# EAGLE design V2 (EAGLE 7.2.0)
DESIGNER: @qrohlf; REVISION: v3
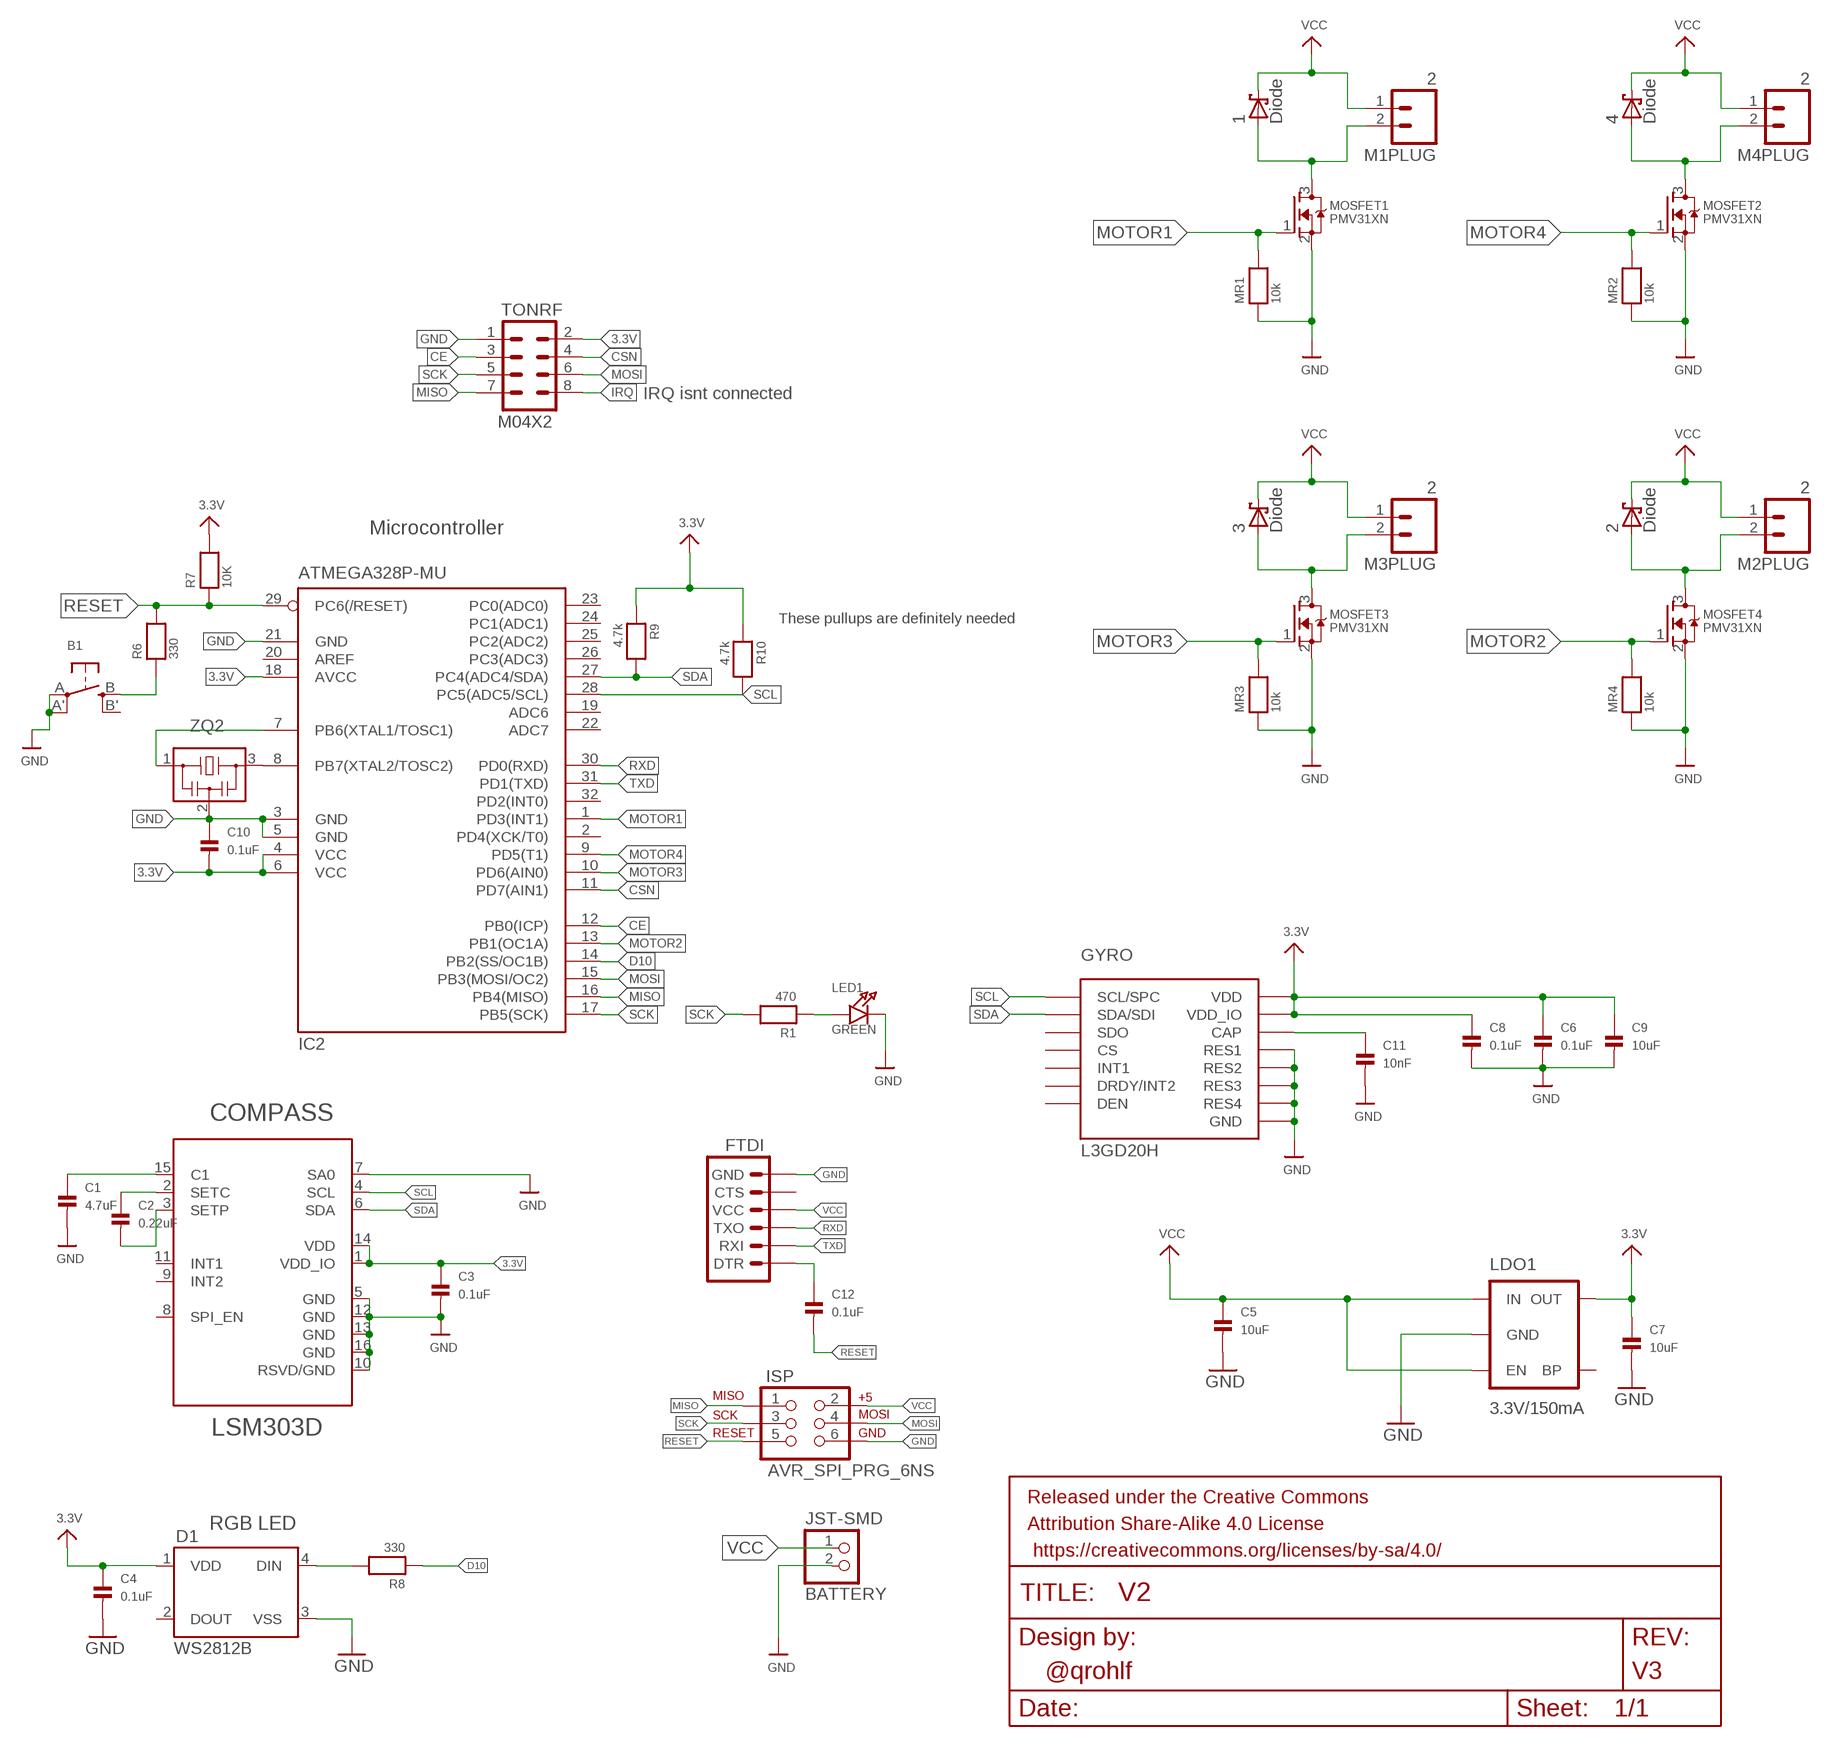
[diagram p0: schematic, sheet 1]

## Parts
1  Diode  BAS40  [SOT23]
2  Diode  BAS40  [SOT23]
3  Diode  BAS40  [SOT23]
4  Diode  BAS40  [SOT23]
B1  SWITCH_TACT_SMT4.6X2.8  [BTN_KMR2_4.6X2.8]
BATTERY  JST-SMD  JST_2PIN-SMT-RA  [JST-PH-2-SMT-RA]
C1  4.7uF  CAP_CERAMIC0603MINI  [0603-MINI]
C2  0.22uF  CAP_CERAMIC0603MINI  [0603-MINI]
C3  0.1uF  CAP_CERAMIC0603MINI  [0603-MINI]
C4  0.1uF  CAP_CERAMIC0603MINI  [0603-MINI]
C5  10uF  CAP_CERAMIC0603MINI  [0603-MINI]
C6  0.1uF  CAP_CERAMIC0603MINI  [0603-MINI]
C7  10uF  CAP_CERAMIC0603MINI  [0603-MINI]
C8  0.1uF  CAP_CERAMIC0603MINI  [0603-MINI]
C9  10uF  CAP_CERAMIC0603MINI  [0603-MINI]
C10  0.1uF  CAP_CERAMIC0603MINI  [0603-MINI]
C11  10nF  CAP_CERAMIC0603MINI  [0603-MINI]
C12  0.1uF  CAP_CERAMIC0603MINI  [0603-MINI]
COMPASS  LSM303D  [LGA16_3X5]
D1  WS2812B  [WS2812B]
FRAME1  >VERSION  FRAME-LETTERNO_PACKAGE  [DUMMY]
FTDI  ARDUINO_SERIAL_PROGRAMLOCK  [1X06_LOCK]
IC2  ATMEGA328P-MU  MEGA8-AI  [TQFP32-08]
ISP  AVR_SPI_PRG_6NS  [2X3-NS]
L3GD20H  L3GD20H  [LGA16L]
LDO1  3.3V/150mA  V_REG_MIC52053.3V  [SOT23-5]
LED1  GREEN  LED0603  [CHIPLED_0603]
M1PLUG  2  M02POLAR_LOCK  [MOLEX-1X2_LOCK]
M2PLUG  2  M02POLAR_LOCK  [MOLEX-1X2_LOCK]
M3PLUG  2  M02POLAR_LOCK  [MOLEX-1X2_LOCK]
M4PLUG  2  M02POLAR_LOCK  [MOLEX-1X2_LOCK]
MOSFET1  PMV31XN  MOSFET-NREFLOW  [SOT23-R]
MOSFET2  PMV31XN  MOSFET-NREFLOW  [SOT23-R]
MOSFET3  PMV31XN  MOSFET-NREFLOW  [SOT23-R]
MOSFET4  PMV31XN  MOSFET-NREFLOW  [SOT23-R]
MR1  10k  RESISTOR0603MINI  [0603-MINI]
MR2  10k  RESISTOR0603MINI  [0603-MINI]
MR3  10k  RESISTOR0603MINI  [0603-MINI]
MR4  10k  RESISTOR0603MINI  [0603-MINI]
R1  470  RESISTOR0603MINI  [0603-MINI]
R6  330  RESISTOR0603MINI  [0603-MINI]
R7  10K  RESISTOR0603MINI  [0603-MINI]
R8  330  RESISTOR0603MINI  [0603-MINI]
R9  4.7k  RESISTOR0603MINI  [0603-MINI]
R10  4.7k  RESISTOR0603MINI  [0603-MINI]
TONRF  M04X2  [2X4]
ZQ2  CSTCE8M00G52-R0  [CSTCE]

## Nets
3.3V: C3.1 C4.1 C6.1 C7.1 C8.1 C9.1 C10.2 COMPASS.1(VDD_IO) COMPASS.14(VDD) D1.1(VDD) IC2.4(VCC) IC2.6(VCC) IC2.18(AVCC) L3GD20H.P$1(VDD_IO) L3GD20H.P$16(VDD) LDO1.5(OUT) R7.2 R9.1 R10.1 TONRF.2
C1: C1.1 COMPASS.15(C1)
CE: IC2.12(PB0(ICP)) TONRF.3
CSN: IC2.11(PD7(AIN1)) TONRF.4
D10: IC2.14(PB2(SS/OC1B)) R8.1
GND: B1.A'(P1) B1.A(P) BATTERY.2 C1.2 C3.2 C4.2 C5.2 C6.2 C7.2 C8.2 C9.2 C10.1 C11.2 COMPASS.5(GND) COMPASS.7(SA0) COMPASS.10(RSVD/GND) COMPASS.12(GND) COMPASS.13(GND) COMPASS.16(GND) D1.3(VSS) FTDI.6(GND) IC2.3(GND) IC2.5(GND) IC2.21(GND) ISP.6 L3GD20H.P$9(RES1) L3GD20H.P$10(RES2) L3GD20H.P$11(RES3) L3GD20H.P$12(GND) L3GD20H.P$13(GND) L3GD20H.P$15(RES4) LDO1.2(GND) LED1.C MOSFET1.2(S) MOSFET2.2(S) MOSFET3.2(S) MOSFET4.2(S) MR1.1 MR2.1 MR3.1 MR4.1 TONRF.1 ZQ2.2
IRQ: TONRF.8
MISO: IC2.16(PB4(MISO)) ISP.1 TONRF.7
MOSI: IC2.15(PB3(MOSI/OC2)) ISP.4 TONRF.6
MOTOR1: IC2.1(PD3(INT1)) MOSFET1.1(G) MR1.2
MOTOR2: IC2.13(PB1(OC1A)) MOSFET4.1(G) MR4.2
MOTOR3: IC2.10(PD6(AIN0)) MOSFET3.1(G) MR3.2
MOTOR4: IC2.9(PD5(T1)) MOSFET2.1(G) MR2.2
N$1: B1.B(S) R6.1
N$2: C12.1 FTDI.1(DTR)
N$4: D1.4(DIN) R8.2
N$5: LED1.A R1.1
N$6: C11.1 L3GD20H.P$14(CAP)
N$7: 3.1(A) M3PLUG.2 MOSFET3.3(D)
N$8: 2.1(A) M2PLUG.2 MOSFET4.3(D)
N$9: IC2.8(PB7(XTAL2/TOSC2)) ZQ2.3
N$10: IC2.7(PB6(XTAL1/TOSC1)) ZQ2.1
N$11: 1.1(A) M1PLUG.2 MOSFET1.3(D)
N$12: 4.1(A) M4PLUG.2 MOSFET2.3(D)
RESET: C12.2 IC2.29(PC6(/RESET)) ISP.5 R6.2 R7.1
RXD: FTDI.3(TXO) IC2.30(PD0(RXD))
SCK: IC2.17(PB5(SCK)) ISP.3 R1.2 TONRF.5
SCL: COMPASS.4(SCL) IC2.28(PC5(ADC5/SCL)) L3GD20H.P$2(SCL/SPC) R10.2
SDA: COMPASS.6(SDA) IC2.27(PC4(ADC4/SDA)) L3GD20H.P$3(SDA/SDI) R9.2
SETC: C2.1 COMPASS.2(SETC)
SETP: C2.2 COMPASS.3(SETP)
TXD: FTDI.2(RXI) IC2.31(PD1(TXD))
VCC: 1.3(C) 2.3(C) 3.3(C) 4.3(C) BATTERY.1 C5.1 FTDI.4(VCC) ISP.2 LDO1.1(IN) LDO1.3(EN) M1PLUG.1 M2PLUG.1 M3PLUG.1 M4PLUG.1
Unconnected: B1.B'(S1) COMPASS.8(SPI_EN) COMPASS.9(INT2) COMPASS.11(INT1) D1.2(DOUT) FTDI.5(CTS) IC2.2(PD4(XCK/T0)) IC2.19(ADC6) IC2.20(AREF) IC2.22(ADC7) IC2.23(PC0(ADC0)) IC2.24(PC1(ADC1)) IC2.25(PC2(ADC2)) IC2.26(PC3(ADC3)) IC2.32(PD2(INT0)) L3GD20H.P$4(SDO) L3GD20H.P$5(CS) L3GD20H.P$6(DRDY/INT2) L3GD20H.P$7(INT1) L3GD20H.P$8(DEN) LDO1.4(BP)

## Notes on the sheet
- IRQ isnt connected
- Microcontroller
- These pullups are definitely needed
- GYRO
- L3GD20H
- RGB LED

## Library data of the parts
1-4 = diode:BAS40: Silicon Schottky Diodes General-purpose diode for high-speed switching
B1 = microbuilder:SWITCH_TACT_SMT: SMT Tact Switches 6x6mm - Digikey: P12940SCT-ND KMR2 (4.6x2.8mm) - Digikey: 401-1426-1-ND EVQ-PQHB55 - Light Touch, 160GF (4.5x4.5mm) - Digikey: P8090SCT-ND
BATTERY = adafruit:JST_2PIN: JST 2-Pin Connectors of various flavors SMT-RA (S2B-PH-SM4) 4UConnector #17311 SMT (B2B-PH-SM4) THM-RA (S2B-PH) THM (B2B-PH)
C1-C12 = microbuilder:CAP_CERAMIC: Ceramic Capacitors 0402 - 0402 Surface Mount Capacitors 16pF 50V 5% [Digikey: 445-4899-2-ND] 18pF 50V 5% [Digikey: 490-1281-2-ND] 22pF 50V 5% [Digikey: 490-1283-2-ND] 68pF 50V 5% [Digikey: 490-1289-2-ND] 0.1uF 10V 10% [Digikey: 490-1318-2-ND] 1.0uF 6.3V 10% [Digikey: 490-1320-2-ND] 0603 - 0603 Surface Mount Capacitors 16 pF 50V 5% [Digikey: 445-5051-2-ND] 22 pF 50V [Digikey: PCC220ACVTR-ND] 33 pF 50V 5% [Digikey: 490-1415-1-ND] 56pF 50V 5% [Digikey: 490-1421-1-ND] 220pF 50V 5% [Digikey: 445-1285-1-ND] 680 pF 50V 2200 pF 50V 5% C0G [Digikey: 445-1297-1-ND] 5600 pF 100V 5% X7R [Digikey: 478-3711-1-ND] 0.1 µF 25V 10% [Digikey: PCC2277TR-ND] 0.22 µF 16V 10% X7R [Digikey: 445-1318-1-ND] 1.0 µF 25V 10% [Digikey: 445-5146-2-ND] 0603 - RF Specific 3pF 250V +/-0.1pF RF [Digikey: 712-1347-1-ND] 18 pF 250V 5% [Digikey: 478-3505-1-ND or 712-1322-1-ND] 56 pF 250V 5% C0G RF [Digikey: 490-4867-1-ND] 68 pF 250V RF [Digikey: 490-4868-1-ND] 0805 - 0805 Surface Mount Capacitors 220 pF 250V 2% RF Ceramic Capacitor [Digikey: 712-1398-1-ND] 1000 pF 50V 2% NP0 Ceramic Capacitor [Digikey: 478-3760-1-ND] 0.1 µF 25V 10% Ceramic Capacitor [Digikey: PCC1828TR-ND] 1.0 µF 16V 10% Ceramic Capacitor[Digikey: 490-1691-2-ND] 10.0 µF 10V 10% Ceramic Capacitor[Digikey: 709-1228-1-ND] 10.0 uF 16V 10% Ceramic Capacitor [Digikey: 478-5165-2-ND] 47 uF 6.3V 20% Ceramic Capacitor [Digikey: 587-1779-1-ND or 399-5506-1-ND] 1206 - 1206 Surface Mount Capacitors 47uF 10V 20% Ceramic Capacitor [Digikey: 490-5528-1-ND or 399-5508-1-ND or 445-6010-1-ND] 100uF 6.3V -20%, +80% Y5V Ceramic Capacitor (Digikey: 490-4512-1-ND, Mouser: 81-GRM31CF50J107ZE1L)
COMPASS = qrohlf:LSM303D: 3-Axis Accelerometer & Compass Sensor
D1 = SparkFun-LED:WS2812B: WS2812B - Intelligent control LED integrated light source Technical Specifications: Power Supply Voltage (VDD): 3.5 to 5.3 V Input Voltage (VI): -0.5 to VDD+0.5 V Operating Junction Temperature (Topt): -25°C to +80°C Storage Temperature Range (Tstg): -55°C to +150°C
FRAME1 = SparkFun-Aesthetics:FRAME-LETTER: Schematic Frame Standard 8.5x11 US Letter frame; DESIGNER: @qrohlf; VERSION: V3
FTDI = SparkFun-Connectors:ARDUINO_SERIAL_PROGRAM: FTDI connector footprints
IC2 = atmel:MEGA8: MICROCONTROLLER 8 Kbytes FLASH, 1 kbytes SRAM, 512 bytes EEPROM, USART, 6-channel 10 bit ADC, 2-channel 8 bit ADC Pin compatible with Atmega48, ATMega88, ATMega168 Source: avr.lbr; MPN: ATMEGA8-16AU; OC_FARNELL: 9171371; OC_NEWARK: 73M8863
ISP = SparkFun-Connectors:AVR_SPI_PRG_6: AVR ISP 6 Pin This is the reduced ISP connector for AVR programming. Common on Arduino. This footprint will take up less PCB space and can be used with a 10-pin to 6-pin adapter such as SKU: BOB-08508 **Special note about "TEST_POINT" package. The stop mask is on the top side, so if you want your programming test points to be on the bottom of your board, make sure to place this package on the bottom side of the board. This also ensure that the orientation to program from the bottom side will be correct.
L3GD20H = st:L3GD20H
LDO1 = SparkFun-PowerIC:V_REG_MIC5205: V_REG MIC5219 Standard 3.3V and 5V 150mA LDO voltage regulator in SOT-23 layout. Micrel part MIC5205. BP (by-pass) pin is used to lower output noise with 470pF cap, may be left open.; PROD_ID: VREG-00822
LED1 = microbuilder:LED: LED 0603 - 0603 Surface Mount Package 2mA: Green LED - Low Power (3.9mcd, 2ma, 1.7Vf) - Digikey: 475-2709-2-ND Orange LED - Low Power (9.8mcd, 2ma, 1.8Vf) - Digikey: 475-1194-2-ND Red LED - Low Power (5mcd, 2ma, 1.8Vf) - Digikey: 475-1195-2-ND Yellow LED - Low Power (7mcd, 2ma, 1.8Vf) - Digikey: 475-1196-2-ND 5mA: Blue LED - Low Power (17mcd, 5ma, 2.9Vf) - Digikey: LNJ937W8CRACT-ND 0805 - 0805 Surface Mount Package 2mA: Red LED (8.8mcd, 2mA, 1.8Vf, Clear) - Low Power [Digikey: 475-2510-1-ND] Green LED (5mcd, 2mA, 1.8Vf, Clear) - Low Power [Digikey: 475-2730-1-ND] Yellow LED (11.3mcd, 2mA, 1.8Vf, Clear) - Low Power [Digikey: 475-2555-1-ND] 20mA: Red LED (104mcd, 20mA, Diffused) - LS R976 [Digikey: 475-1278-6-ND] Red LED (12mcd, 20mA, 2.0Vf, Clear) - APT2012EC [Digikey: 754-1128-1-ND] Green LED (15mcd, 20mA, 2.2Vf, Clear) - APT2012GC [Digikey: 754-1131-1-ND] Orange LED (160mcd, 20mA, 2.1Vf, Clear) - APT2012SECK [Digikey: 754-1130-1-ND] 1206 - 1206 Surface Mount Package Green LED (26mcd, 20mA, Diffused) - LG N971 [Digikey: 475-1407-6-ND] Red LED (15mcd, 20mA, Diffused) - LH N974 [Digikey: 475-1416-6-ND]
M1PLUG M2PLUG M3PLUG M4PLUG = SparkFun-Connectors:M02: Standard 2-pin 0.1" header. Use with - straight break away headers ( PRT-00116) - right angle break away headers (PRT-00553) - swiss pins (PRT-00743) - machine pins (PRT-00117) - female headers (PRT-00115) Molex polarized connector foot print use with: PRT-08233 with associated crimp pins and housings. 2.54_SCREWTERM for use with PRT-10571. 3.5mm Screw Terminal footprints for PRT-08084 5mm Screw Terminal footprints for use with PRT-08432
MOSFET1-MOSFET4 = microbuilder:MOSFET-N: N-Channel Mosfet LEGEND VDS: Voltage Drain-Source ID: Drain Current RDS(ON): Drain-Source On-State Resistance VGS(TH): Gate-Source Threshold Voltage CISS: Drain-Source Input Capacitance SOT-23 Name VDS ID RDS(ON) VGS(TH) CISS Order Number 2N7002E 60V 260mA 2.5 Ohm 2.5V @ 250uA 26.7pF @ 25V 2N7002ET1GOSTR-ND BSH103 30V 850mA 400 mOhm 400mV @ 1mA 83pF @ 24V BSH103,235-ND BSS138 60V 320mA 1.6 Ohm 1.5V @ 250uA 50pF @ 10V Mouser: 771-BSS138PW115 DMN2075U-7 20V 4.2A 38 mOhm 1V @ 250 uA 594.3pF @ 10V DMN2075U-7DICT-ND * BSS138 good choice for I2C level-shifting
MR1-MR4 R1 R6-R10 = microbuilder:RESISTOR: Resistors 0402 - 0402 Surface Mount Package 22 Ohm 1% 1/16W [Digikey: 311-22.0LRTR-ND] 33 Ohm 5% 1/16W 1.0K 5% 1/16W 1.5K 5% 1/16W 2.0K 1% 1/16W 10.0K 1% 1/16W [Digikey: 311-10.0KLRTR-ND] 10.0K 5% 1/16W [Digikey: RMCF0402JT10K0TR-ND] 12.1K 1% 1/16W [Digikey: 311-22.0LRTR-ND] 100.0K 5% 1/16W 0603 - 0603 Surface Mount Package 0 Ohm 1/10 Watt 1% Resistor 15 Ohm 1/10 Watt 1% Resistor 33 Ohm 1/10 Watt 1% Resistor 49.9 Ohm 1/10 Watt 1% Resistor 100 Ohm 1/10 Watt 1% Resistor 150 Ohm 1/10 Watt 1% Resistor 240 Ohm 1/10 Watt 1% Resistor 390 Ohm 1/10 Watt 1% Resistor 560 Ohm 1/10 Watt 1% Resistor 680 Ohm 1/10 Watt 1% Resistor 750 Ohm 1/10 Watt 1% Resistor 1.0K Ohm 1/10 Watt 1% Resistor 1.5K Ohm 1/10 Watt 1% Resistor 2.0K Ohm 1/10 Watt 1% Resistor 2.2K Ohm 1/10 Watt 1% Resistor 3.3K Ohm 1/10 Watt 1% Resistor 4.7K Ohm 1/10 Watt 1% Resistor 10.0K Ohm 1/10 Watt 1% Resistor 12.0K Ohm 1/10 Watt 1% Resistor 12.1K Ohm 1/10 Watt 1% Resistor 20.0K Ohm 1/10 Watt 1% Resistor 33.0K Ohm 1/10 Watt 1% Resistor 100.0K Ohm 1/10 Watt 1% Resistor 0805 - 0805 Surface Mount Package 0 Ohm 1/8 Watt 1% Resistor 33 Ohm 1/8 Watt 1% Resistor 100 Ohm 1/8 Watt 1% Resistor 150 Ohm 1/8 Watt 1% Resistor 200 Ohm 1/8 Watt 1% Resistor 240 Ohm 1/8 Watt 1% Resistor 330 Ohm 1/8 Watt 1% Resistor 390 Ohm 1/8 Watt 1% Resistor 470 Ohm 1/8 Watt 1% Resistor 1.0K Ohm 1/8 Watt 1% Resistor 1.5K Ohm 1/8 Watt 1% Resistor 2.0K Ohm 1/8 Watt 1% Resistor 4.7K Ohm 1/8 Watt 1% Resistor 5.1K Ohm 1/8 Watt 1% Resistor 5.6K Ohm 1/8 Watt 1% Resistor 10.0K Ohm 1/8 Watt 1% Resistor 22.0K Ohm 1/8 Watt 1% Resistor 33.0K Ohm 1/8 Watt 1% Resistor 100K Ohm 1/8 Watt 1% Resistor 1206 - 1206 Surface Mount Package 2012 - 2010 Surface Mount Package 0.11 Ohm 1/2 Watt 1% Resistor - Digikey: RHM.11UCT-ND
TONRF = SparkFun-Connectors:M04X2: .1" header, two rows of four.
ZQ2 = cstce-resonator:CSTC?: Resonator CSTCR ­- 2.0 x 4.5 mm <http://search.murata.co.jp/Ceramy/CatalogAction.do?sHinnm=?&nbsp&sNHinnm=CSTCR6M00G53-R0&sNhin_key=CSTCR6M00G53-R0&sLang=en&sParam=CSTCR> CSTCE ­- 1.3 x 3.2 mm <http://search.murata.co.jp/Ceramy/CatalogAction.do?sHinnm=?&nbsp&sNHinnm=CSTCE8M00G52-R0&sNhin_key=CSTCE8M00G52-R0&sLang=en&sParam=CSTCE>; FREQUENCY: 8 MHz; OC_MOUSER: 81-CSTCE8M00G52-R0

## Board
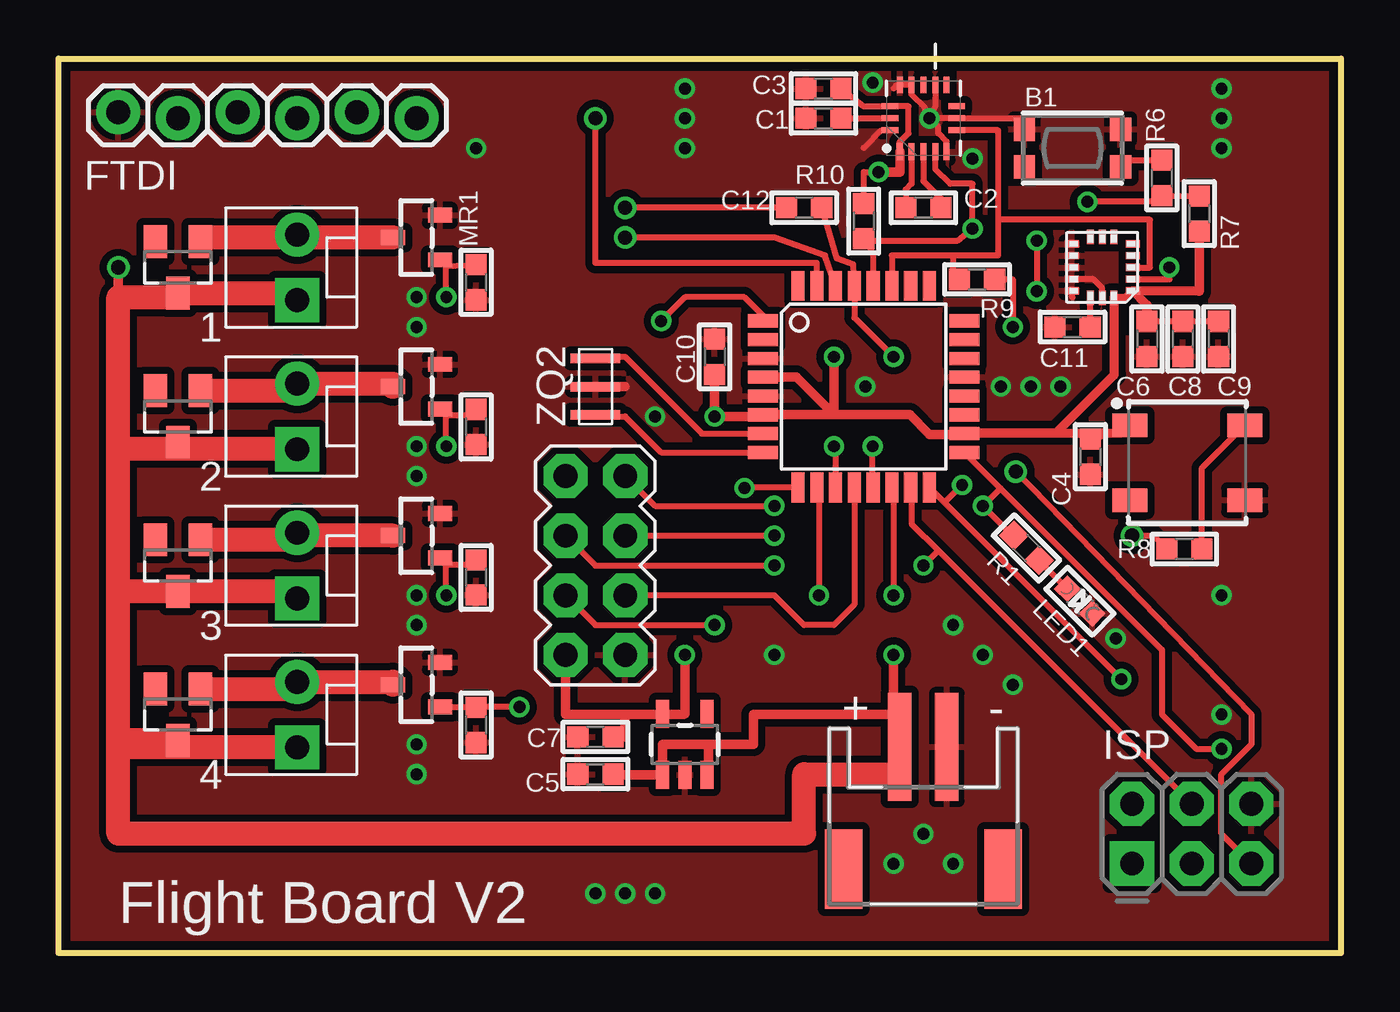
[diagram p1: board, top side]
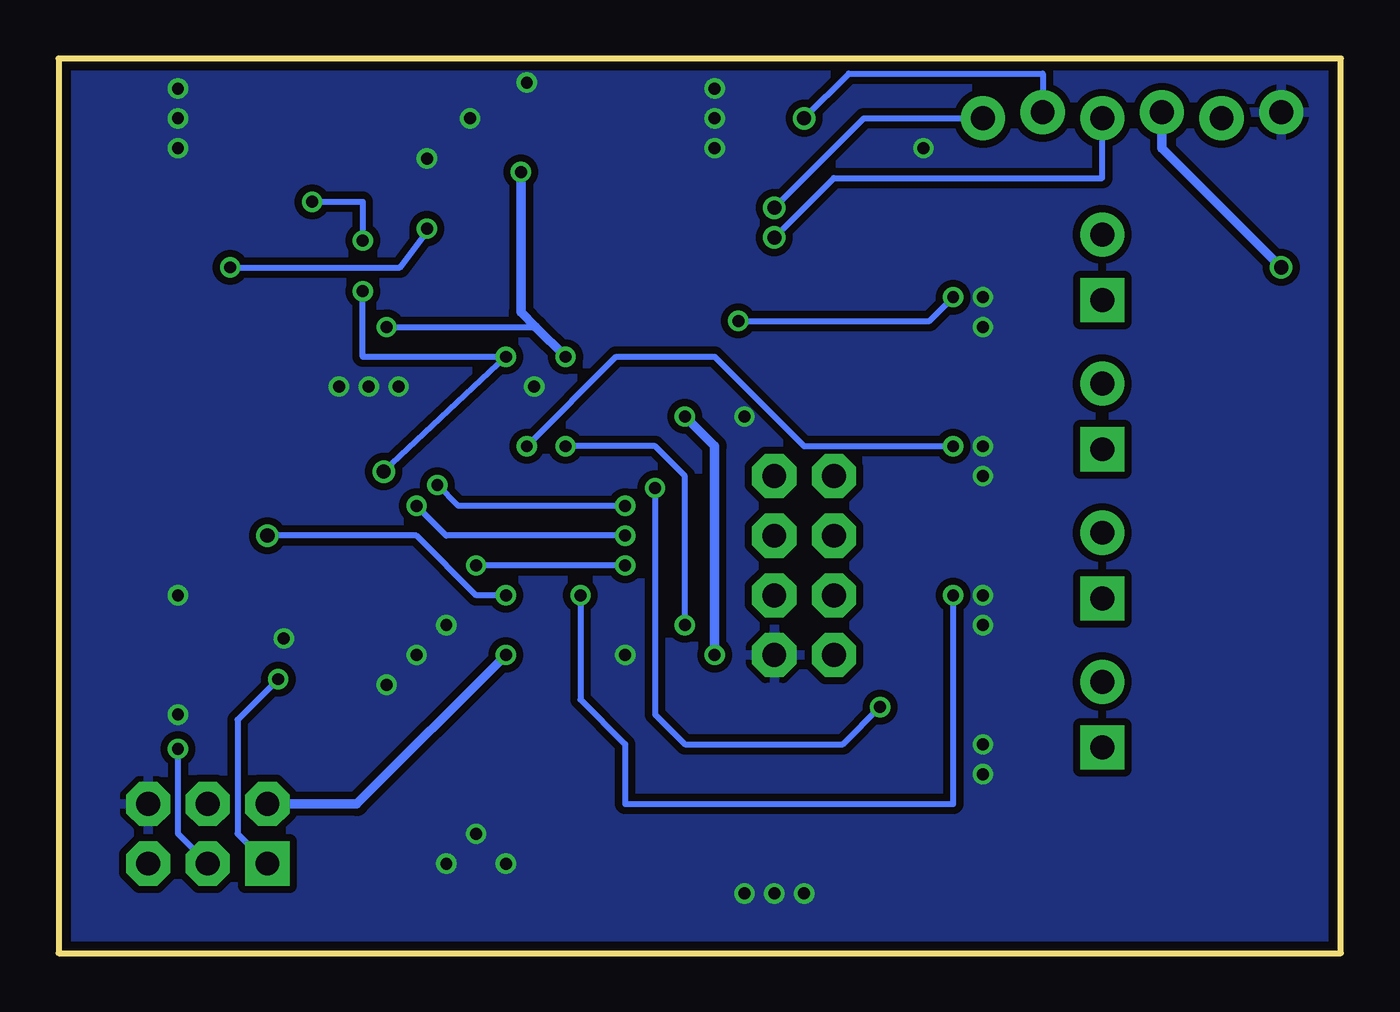
[diagram p2: board, bottom side, seen from below]

Size 54.61 x 38.1 mm. Coordinates in mm from the lower left corner, seen from the top.
Outline: 0,0 0,38.1 54.61,38.1 54.61,0 0,0
Copper layers (1*16): Top 0.0356mm / dielectric 1.5011mm / Bottom 0.0356mm
Design rules "oshpark-2layer *": minimum track width 6mil, minimum drill 13mil, track to track 6mil, track to pad 6mil, pad to pad 6mil, via to via 6mil, smd to smd 6mil, copper to edge 15mil, drill to drill 6mil, minimum pad ring 7mil, minimum via ring 7mil, stop-mask expansion 4mil, vias tented up to drill 25mil, thermal gap 10mil

### Footprints (pad centres in the part's own frame; a part is rotated, then mirrored left to right if it is on the bottom)
SOT23 = smd 1 x 1.4: 1 -0.95,-1.1; 2 0.95,-1.1; 3 0,1.1
BTN_KMR2_4.6X2.8 = smd 0.9 x 1: A 2.05,0.8; A' -2.05,0.8; B 2.05,-0.8; B' -2.05,-0.8
JST-PH-2-SMT-RA = smd 1 x 4.6: 1 1,-3.7; 2 -1,-3.7 | smd 1.6 x 3.4: NC1 -3.4,1.5; NC2 3.4,1.5
0603-MINI = smd 0.9 x 0.9: 1 -0.75,0; 2 0.75,0
LGA16_3X5 = smd 0.711 x 0.254: 1 -1.422,0.991; 2 -1.422,0.508; 3 -1.422,0; 4 -1.422,-0.508; 5 -1.422,-0.991; 9 1.422,-0.991; 10 1.422,-0.508; 11 1.422,0; 12 1.422,0.508; 13 1.422,0.991 | smd 0.254 x 0.711: 6 -0.508,-1.422; 7 0,-1.422; 8 0.508,-1.422; 14 0.508,1.422; 15 0,1.422; 16 -0.508,1.422
WS2812B = smd 1.5 x 1: 1 -2.45,1.6; 2 -2.45,-1.6; 3 2.45,-1.6; 4 2.45,1.6
1X06_LOCK = drill 1.016 pad 1.88: 1 0,0; 2 2.54,-0.254; 3 5.08,0; 4 7.62,-0.254; 5 10.16,0; 6 12.7,-0.254
TQFP32-08 = smd 1.27 x 0.559: 1 -4.293,2.8; 2 -4.293,2; 3 -4.293,1.2; 4 -4.293,0.4; 5 -4.293,-0.4; 6 -4.293,-1.2; 7 -4.293,-2; 8 -4.293,-2.8; 17 4.293,-2.8; 18 4.293,-2; 19 4.293,-1.2; 20 4.293,-0.4; 21 4.293,0.4; 22 4.293,1.2; 23 4.293,2; 24 4.293,2.8 | smd 0.559 x 1.27: 9 -2.8,-4.293; 10 -2,-4.293; 11 -1.2,-4.293; 12 -0.4,-4.293; 13 0.4,-4.293; 14 1.2,-4.293; 15 2,-4.293; 16 2.8,-4.293; 25 2.8,4.293; 26 2,4.293; 27 1.2,4.293; 28 0.4,4.293; 29 -0.4,4.293; 30 -1.2,4.293; 31 -2,4.293; 32 -2.8,4.293
2X3-NS = drill 1.016 pad 1.88 square: 1 -2.54,-1.27 | drill 1.016 pad 1.88 octagon: 2 -2.54,1.27; 3 0,-1.27; 4 0,1.27; 5 2.54,-1.27; 6 2.54,1.27
LGA16L = smd 0.6 x 0.3: P$1 -1.3,1; P$2 -1.3,0.5; P$3 -1.3,0; P$4 -1.3,-0.5; P$5 -1.3,-1; P$9 1.3,-1; P$10 1.3,-0.5; P$11 1.3,0; P$12 1.3,0.5; P$13 1.3,1 | smd 0.3 x 0.6: P$6 -0.5,-1.3; P$7 0,-1.3; P$8 0.5,-1.3; P$14 0.5,1.3; P$15 0,1.3; P$16 -0.5,1.3
SOT23-5 = smd 0.55 x 1.2: 1 -0.95,-1.3; 2 0,-1.3; 3 0.95,-1.3; 4 0.95,1.3; 5 -0.95,1.3
CHIPLED_0603 = smd 0.8 x 0.8: A 0,-0.75; C 0,0.75
MOLEX-1X2_LOCK = drill 1.016 pad 1.88 square: 1 -0.127,0 | drill 1.016 pad 1.88: 2 2.667,0
SOT23-R = smd 0.635 x 1.016: 1 -0.95,-1; 2 0.95,-1; 3 0,1
2X4 = drill 1.016 pad 1.88 octagon: 1 -3.81,-1.27; 2 -3.81,1.27; 3 -1.27,-1.27; 4 -1.27,1.27; 5 1.27,-1.27; 6 1.27,1.27; 7 3.81,-1.27; 8 3.81,1.27
CSTCE = smd 0.4 x 2.1: 1 -1.2,0; 2 0,0; 3 1.2,0

### Placement (x,y rotation side)
1  5.08,29.21 180 top
2  5.08,22.86 180 top
3  5.08,16.51 180 top
4  5.08,10.16 180 top
B1  43.18,34.29 0 top
BATTERY  36.83,5.08 180 top
C1  32.58,35.56 180 top
C2  36.83,31.75 0 top
C3  32.58,36.83 180 top
C4  43.94,21.15 270 top
C5  22.86,7.62 180 top
C6  46.36,26.16 270 top
C7  22.86,9.21 180 top
C8  47.88,26.16 270 top
C9  49.4,26.16 270 top
C10  27.94,25.4 270 top
C11  43.18,26.67 180 top
C12  31.75,31.75 0 top
COMPASS  36.83,35.56 90 top
D1  48.07,20.89 0 top
FRAME1  55.88,26.67 0 top
FTDI  15.24,35.56 180 top
IC2  34.29,24.13 0 top
ISP  48.26,5.08 0 top
L3GD20H  44.45,29.21 180 top
LDO1  26.67,8.89 0 top
LED1  43.49,14.99 225 top
M1PLUG  10.16,27.94 90 top
M2PLUG  10.16,21.59 90 top
M3PLUG  10.16,15.24 90 top
M4PLUG  10.16,8.89 90 top
MOSFET1  15.24,30.48 90 top
MOSFET2  15.24,11.43 90 top
MOSFET3  15.24,17.78 90 top
MOSFET4  15.24,24.13 90 top
MR1  17.78,28.57 90 top
MR2  17.78,9.72 90 top
MR3  17.78,16 90 top
MR4  17.78,22.42 90 top
R1  41.22,17.26 135 top
R6  46.99,33.02 270 top
R7  48.58,31.5 270 top
R8  47.94,17.21 0 top
R9  39.12,28.7 180 top
R10  34.29,31.18 270 top
TONRF  22.86,16.51 90 top
ZQ2  22.86,24.13 270 top

### Tracks (layer width: path | path; a pad name or v marks a point on that pad's centre or on a via)
3.3V  (via drill 0.51)
  Top 0.254: 35.81,34.11 COMPASS.1 35.81,34.16 35.81,34.54 36.2,34.93 36.2,36.07 COMPASS.14 34.28,36.07 C3.1 | LDO1.5 26.67,10.19 | 29.93,22.86 IC2.6 | R10.1 34.29,33.27 v34.93,33.27 | R9.1 40.64,28.7 v40.64,26.67 | C6.1 C8.1 C9.1
  Top 0.381: 44.95,24.63 L3GD20H.P$16 45.45,27.91 L3GD20H.P$1 | L3GD20H.P$1 46.36,27.61 | 48.58,28.19 45.77,28.19 L3GD20H.P$1 | 42.48,22.16 44.45,22.16 | 44.45,22.16 45.29,22.16 D1.1 | C4.1 44.18,21.89 44.45,22.16
  Top 0.406: IC2.6 33.02,22.93 | 33.02,22.93 36.25,22.93 37.08,22.1 38.55,22.1 IC2.18 38.61,22.16 42.48,22.16 44.95,24.63 | IC2.4 31.42,24.53 33.02,22.93 | TONRF.2 21.59,10.16 24.13,10.16 | 24.13,10.16 26.64,10.16 26.67,10.19 v26.67,12.7 | 29.93,22.86 v27.94,22.86 C10.2 | v33.02,25.4 33.02,22.93 | v34.93,33.27 35.84,33.27 COMPASS.1 | C7.1 24.13,9.21 24.13,10.16 | 46.36,27.61 C6.1 | 48.58,28.19 R7.2
  Bottom 0.254: v40.64,26.67 34.29,26.67
  Bottom 0.406: v26.67,12.7 26.67,21.59 v27.94,22.86 | v34.93,33.27 34.93,27.3 34.29,26.67 v33.02,25.4
C1
  Top 0.254: C1.1 COMPASS.15
CE
  Top 0.254: IC2.12 33.89,14.84 33.02,13.97 31.75,13.97 30.48,15.24 TONRF.3
CSN  (via drill 0.51)
  Top 0.254: v33.02,21.59 33.09,21.52 IC2.11 | TONRF.4 22.86,13.97 v27.94,13.97
  Bottom 0.254: v27.94,13.97 27.94,20.32 29.21,21.59 v33.02,21.59
D10  (via drill 0.51, 0.6)
  Top 0.254: IC2.14 35.56,19.84 v35.56,15.24 | v45.72,17.78 46.62,17.78 R8.1
  Bottom 0.254: v35.56,15.24 36.83,15.24 39.37,17.78 v45.72,17.78
GND  (via drill 0.51)
  Top 0.254: v37.08,35.56 COMPASS.7 41.13,35.56 B1.A' | 35.56,36.83 35.71,36.98 COMPASS.12 36.32,36.58 36.89,36 36.89,35.75 v37.08,35.56 | COMPASS.10 37.34,36.07 v37.08,35.56 | COMPASS.5 37.82,34.57 37.47,34.93 37.47,35.18 v37.08,35.56 | COMPASS.16 35.05,35.05 34.29,34.29 | L3GD20H.P$13 43.15,27.97 43.18,27.94 | L3GD20H.P$15 44.45,28.32 44.07,28.7 L3GD20H.P$12
  Top 0.406: ZQ2.2 24.13,24.13
  other vias: 25.4,22.86 30.48,12.7 15.24,21.59 15.24,27.94 15.24,15.24 15.24,8.89 15.24,26.67 15.24,20.32 15.24,13.97 15.24,7.62 41.4,24.13 34.35,24.13 34.67,37.08 36.83,5.08 35.56,3.81 38.1,3.81 40.13,24.13 42.67,24.13 22.86,2.54 24.13,2.54 25.4,2.54 38.93,33.85 17.78,34.29 26.67,35.56 39.37,12.7 49.53,10.16 26.67,36.83 26.67,34.29 49.53,36.83 49.53,35.56 49.53,34.29 45.02,13.4 38.1,13.97 40.64,11.43 49.53,15.24
  pour Top (isolate 0.305): 0,0 0,38.1 54.61,38.1 54.61,0
  pour Bottom (isolate 0.305): 0,0 54.61,0 54.61,38.1 0,38.1
MISO  (via drill 0.51)
  Top 0.254: v38.48,19.94 37.74,19.19 | TONRF.7 25.4,19.05 v30.48,19.05 | 37.74,19.19 v45.26,11.67 | 37.74,19.19 IC2.16
  Bottom 0.254: v30.48,19.05 37.59,19.05 v38.48,19.94 | v45.26,11.67 46.99,9.94 46.99,5.08 ISP.1
  Bottom 0.406: v45.26,11.67 45.29,11.67
MOSI  (via drill 0.51)
  Top 0.254: TONRF.6 22.86,16.51 v30.48,16.51 | 36.32,19.8 36.32,18.29 37.47,17.14 | 37.47,17.14 ISP.4 | v36.83,16.51 37.47,17.14
  Top 0.406: 36.32,19.8 IC2.15
  Bottom 0.254: v30.48,16.51 v36.83,16.51
MOTOR1  (via drill 0.51)
  Top 0.254: IC2.1 30,27.15 29.21,27.94 26.67,27.94 v25.66,26.93 | v16.51,27.94 16.51,29.26 | 16.51,29.26 MOSFET1.1 | 16.51,29.26 MR1.2
  Bottom 0.254: v25.66,26.93 17.52,26.93 v16.51,27.94
MOTOR2  (via drill 0.51)
  Top 0.254: IC2.13 34.67,19.86 v34.67,21.59 | v16.51,21.59 16.51,22.91 | 16.51,22.91 MOSFET4.1 | 16.51,22.91 17.52,22.91 MR4.2
  Bottom 0.254: v34.67,21.59 30.86,25.4 26.67,25.4 22.86,21.59 v16.51,21.59
MOTOR3  (via drill 0.51)
  Top 0.254: IC2.10 32.38,19.84 v32.38,15.24 | v16.51,15.24 16.51,16.56 | 16.51,16.56 MOSFET3.1 | 16.51,16.56 17.59,16.56 MR3.2
  Bottom 0.254: v32.38,15.24 32.38,10.79 30.48,8.89 30.48,6.35 16.51,6.35 v16.51,15.24
MOTOR4  (via drill 0.51)
  Top 0.254: IC2.9 29.21,19.84 v29.21,19.81 | v19.62,10.48 17.79,10.48 MR2.2 17.77,10.48 MOSFET2.1
  Bottom 0.254: v29.21,19.81 29.21,10.16 27.94,8.89 21.21,8.89 v19.62,10.48
N$1
  Top 0.254: B1.B 45.51,33.77 R6.1
N$2  (via drill 0.6)
  Top 0.254: C12.1 v24.13,31.75
  Bottom 0.254: v24.13,31.75 20.32,35.56 FTDI.1
N$4
  Top 0.254: R8.2 48.69,20.66 D1.4
N$5
  Top 0.254: R1.1 LED1.A
N$6
  Top 0.254: L3GD20H.P$14 43.93,27.89 C11.1
N$7
  Top 1.016: MOSFET3.3 10.16,17.78 M3PLUG.2 10.16,17.61 3.1
N$8
  Top 1.016: 2.1 10.16,23.96 M2PLUG.2 14.24,24.26 MOSFET4.3
N$9
  Top 0.254: ZQ2.3 22.93,22.86 24.13,22.86 25.66,21.33 IC2.8
N$10
  Top 0.254: ZQ2.1 22.93,25.4 24.13,25.4 27.4,22.13 IC2.7
N$11
  Top 0.406: 6.03,30.61 1.1
  Top 1.016: MOSFET1.3 10.16,30.48 | 10.16,30.48 M1PLUG.2 | 10.16,30.48 6.03,30.48 1.1
N$12
  Top 1.016: 4.1 10.16,11.26 M4PLUG.2 14.24,11.56 MOSFET2.3
RESET  (via drill 0.51, 0.6)
  Top 0.254: v43.82,32 46.74,32 46.74,32.27 R6.2 R7.1 | v41.66,30.35 v41.66,28.19 | v35.56,25.4 33.89,27.07 IC2.29 33.85,29.34 33.15,29.59 C12.2 | ISP.5 49.53,5.08 49.53,7.62 50.8,8.89 50.8,10.16 v40.77,20.51
  Bottom 0.254: v43.82,32 41.66,32 v41.66,30.35 | v41.66,28.19 41.66,25.4 v35.56,25.4 v40.77,20.51
RXD  (via drill 0.6)
  Top 0.254: IC2.30 32.64,29.72 30.48,30.48 v24.13,30.48
  Bottom 0.254: v24.13,30.48 21.59,33.02 10.16,33.02 FTDI.3
SCK  (via drill 0.51)
  Top 0.254: 40.12,19.8 v39.37,19.05 40.63,17.79 R1.2 | TONRF.5 v30.48,17.78 | IC2.17 40.12,19.8 | 40.12,19.8 46.99,12.92 46.99,10.16 48.45,8.7 v49.53,8.7
  Bottom 0.254: v30.48,17.78 38.1,17.78 v39.37,19.05 | ISP.3 49.53,5.08 v49.53,8.7
SCL  (via drill 0.51)
  Top 0.254: IC2.28 34.69,29.77 R10.2 34.29,30.35 38.29,30.35 v38.93,30.86 38.93,32.77 37.97,32.77 37.34,33.4 COMPASS.4 | L3GD20H.P$2 47.31,28.7 v47.31,29.21
  Bottom 0.254: v47.31,29.21 40.07,29.21 38.86,30.81 v38.93,30.86
SDA
  Top 0.254: COMPASS.6 40.01,35.05 40.01,31.24 | 40.01,31.24 40.01,29.72 38.1,29.72 | 38.1,29.72 35.49,29.72 IC2.27 | L3GD20H.P$3 46.48,29.21 46.48,31.24 40.01,31.24 | R9.2 38.1,28.7 38.1,29.72
SETC
  Top 0.254: COMPASS.2 36.32,32.77 36.08,32.52 C2.1
SETP
  Top 0.254: COMPASS.3 36.83,32.89 37.58,32.14 C2.2
TXD  (via drill 0.6)
  Top 0.254: IC2.31 32.29,29.4 22.86,29.4 v22.86,35.56
  Bottom 0.254: v22.86,35.56 20.95,37.47 12.7,37.47 FTDI.2
VCC  (via drill 0.51, 0.6)
  Top 0.381: 35.83,9.53 BATTERY.1
  Top 0.406: 27.69,8.89 25.72,8.89 LDO1.1 23.64,7.59 C5.1 | 27.69,8.89 27.69,7.59 LDO1.3 | 2.3 10.16,21.76 M2PLUG.1 | 10.16,28.11 10.16,27.94 | 3.3 10.16,15.41 M3PLUG.1 | 27.69,8.89 29.59,8.89 29.59,10.16 35.56,10.16 35.56,9.53 35.83,9.53 | BATTERY.1 35.56,8.78 v35.56,12.7 | v2.54,29.21 2.54,27.94
  Top 1.016: 10.16,27.94 M1PLUG.1 10.16,28.11 1.3 5.08,27.94 2.54,27.94 2.54,21.46 | 2.54,8.76 2.54,5.08 31.75,5.08 31.75,7.62 35.56,7.62 35.83,7.89 BATTERY.1 | 2.54,8.76 2.54,9.06 | 2.54,9.06 2.54,15.41 | 2.54,15.41 2.54,21.46 | 4.3 2.54,9.06 | M2PLUG.1 2.54,21.46 | 10.16,15.41 2.54,15.41 | M4PLUG.1 2.54,8.76
  Bottom 0.406: v35.56,12.7 41.91,6.35 ISP.2 | FTDI.4 7.62,34.29 v2.54,29.21

### Text on the board
tNames: Flight Board V2